# Altium schematic sheet Sheet2.SchDoc
size A3
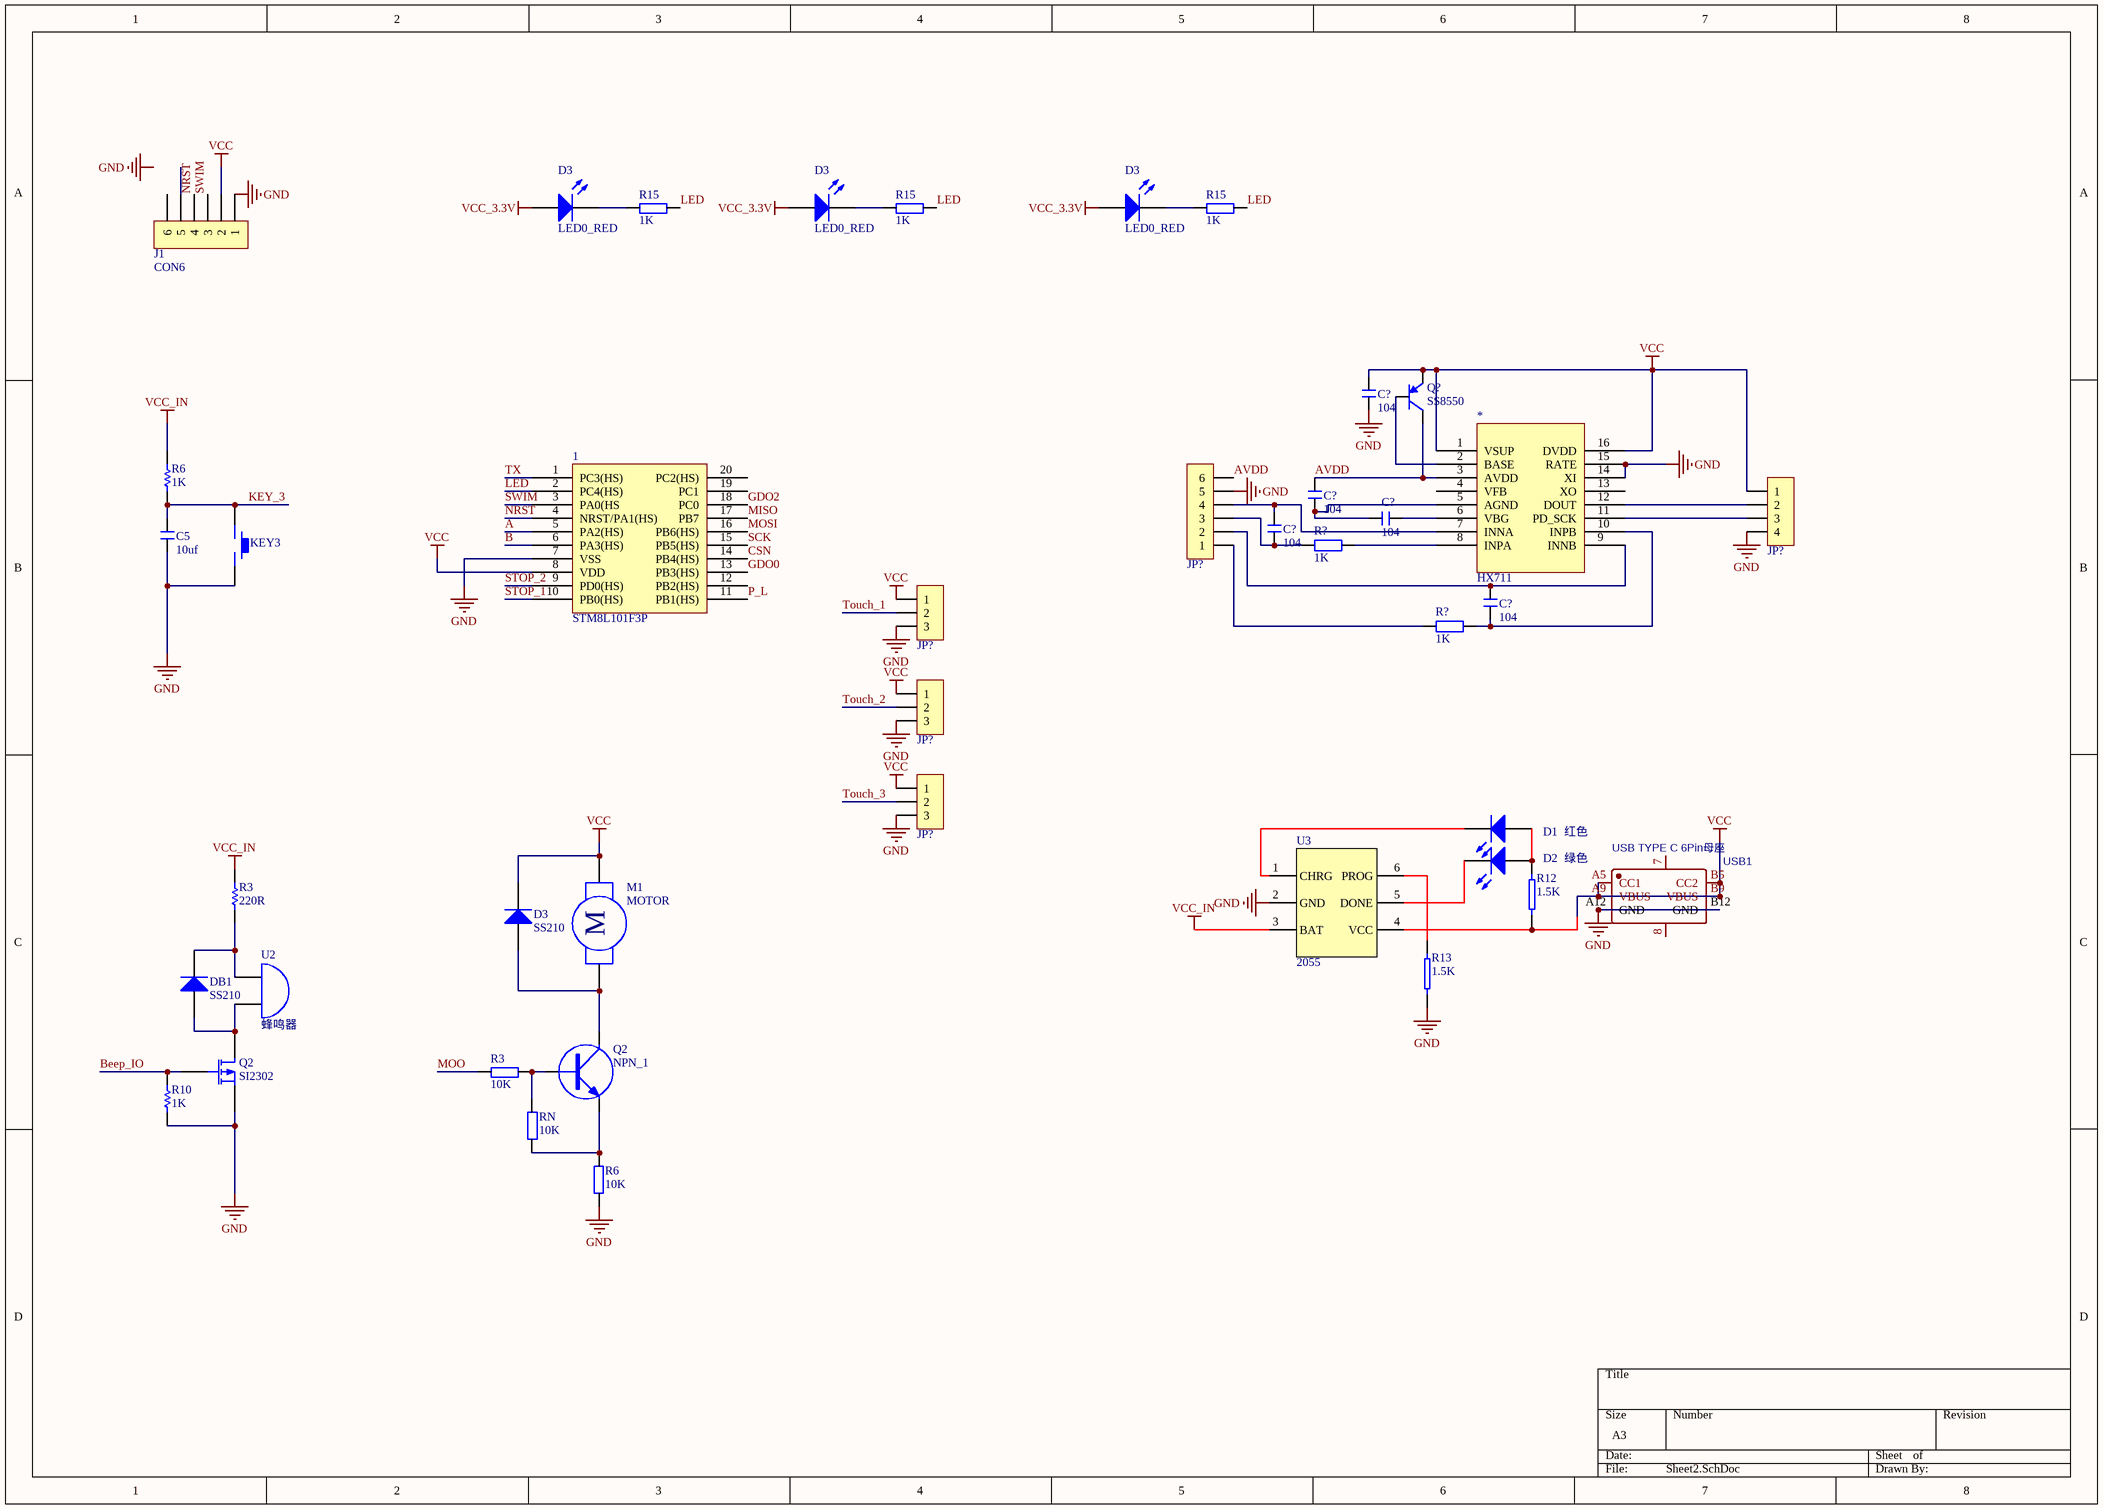
[diagram p0: Sheet2.SchDoc]

## Parts
(Parts that share a designator on the sheet are numbered #1, #2 ... from top to bottom, then left to right.)
1  STM8L101F3P  [TSSOP20]
*  HX711  [Model Name]
C5  10uf  [C0805]
C?#1  104  [C 0201_L]
C?#2  104  [C 0201_L]
C?#3  104  [C 0201_L]
C?#4  104  [C 0201_L]
C?#5  104  [C 0201_L]
D1  红色  [led0805]
D2  绿色  [led0805]
D3#1  LED0_RED  [LED0805]
D3#2  LED0_RED  [LED0805]
D3#3  LED0_RED  [LED0805]
D3#4  SS210  [1206]
DB1  SS210  [1206]
J1  CON6  [HDR2.54-LI-4P]
JP?#1  HDR-1X4  [HDR2.54-LI-4P]  (value not drawn)
JP?#2  HDR-1X6  [HDR2.54-LI-6P]  (value not drawn)
JP?#3  HDR-1X3  [HDR2.54-LI-3P]  (value not drawn)
JP?#4  HDR-1X3  [HDR2.54-LI-3P]  (value not drawn)
JP?#5  HDR-1X3  [HDR2.54-LI-3P]  (value not drawn)
KEY3  KEY_M  [SW_PB4_A1]  (value not drawn)
M1  MOTOR  [0805]
Q2#1  NPN_1  [SOT-23]
Q2#2  SI2302  [SOT-23]
Q?  SS8550  [SOT23-3L]
R3#1  value 220R  [0805]  (hidden comment: Res)
R3#2  10K  [0805]
R6#1  value 1K  [0805]  (hidden comment: Res)
R6#2  10K  [0805]
R10  value 1K  [0805]  (hidden comment: Res)
R12  1.5K  [0805]
R13  1.5K  [0805]
R15#1  1K  [0805]
R15#2  1K  [0805]
R15#3  1K  [0805]
R?#1  1K  [R 0201_L]
R?#2  1K  [R 0201_L]
RN  10K  [R0805]
U2  蜂鸣器  [BELL 5mm]
U3  2055  [SOT23-6L]
USB1  USB TYPE C 6Pin母座  [USB-C-SMD_10P-P1.00-L6.8-W8.9]

## Nets
GND: 1.7(VSS) *.14(XI) *.15(RATE) C5.1 C?#1.1 J1.1 JP?#1.4 JP?#2.5 JP?#3.3 JP?#4.3 JP?#5.3 KEY3.2 Q2#2.S R6#2.2 R10.1 R13.2 U3.2(GND) USB1.A12(GND) USB1.B12(GND)
VCC: 1.8(VDD) *.1(VSUP) *.16(DVDD) C?#1.2 D3#4.2(K) J1.2 JP?#1.1 JP?#3.1 JP?#4.1 JP?#5.1 M1.1 Q?.2(E) R12.1 U3.4(VCC) USB1.A5(CC1) USB1.A9(VBUS) USB1.B5(CC2) USB1.B9(VBUS)
VCC_3.3V: D3#1.1(A) D3#2.1(A) D3#3.1(A)
VCC_IN: R3#1.2 R6#1.1 U3.3(BAT)
A: 1.5(PA2(HS))
AVDD: *.3(AVDD) C?#2.2 JP?#2.6 Q?.3(C)
B: 1.6(PA3(HS))
Beep_IO: Q2#2.G R10.2
CSN: 1.14(PB4(HS))
GDO0: 1.13(PB3(HS))
GDO2: 1.18(PC0)
KEY_3: C5.2 KEY3.1 R6#1.2
LED: 1.2(PC4(HS)) R15#1.2 R15#2.2 R15#3.2
MISO: 1.17(PB7)
MOO: R3#2.1
MOSI: 1.16(PB6(HS))
NRST: 1.4(NRST/PA1(HS)) J1.4
P_L: 1.11(PB1(HS))
SCK: 1.15(PB5(HS))
STOP_1: 1.10(PB0(HS))
STOP_2: 1.9(PD0(HS))
SWIM: 1.3(PA0(HS) J1.3
Touch_1: JP?#3.2
Touch_2: JP?#4.2
Touch_3: JP?#5.2
TX: 1.1(PC3(HS))
Net*_2: *.2(BASE) Q?.1(B)
Net*_5: *.5(AGND) C?#2.1 C?#3.2
Net*_6: *.6(VBG) C?#3.1
Net*_7: *.7(INNA) C?#4.2 JP?#2.4
Net*_8: *.8(INPA) R?#1.2
Net*_9: *.9(INNB) C?#5.2 JP?#2.2
Net*_10: *.10(INPB) C?#5.1 R?#2.2
Net*_11: *.11(PD_SCK) JP?#1.3
Net*_12: *.12(DOUT) JP?#1.2
NetC?#4_1: C?#4.1 JP?#2.3 R?#1.1
NetD1_1: D1.1 D2.1 R12.2
NetD1_2: D1.2 U3.1(CHRG)
NetD2_2: D2.2 U3.5(DONE)
NetD3#1_2: D3#1.2(K) R15#1.1
NetD3#2_2: D3#2.2(K) R15#2.1
NetD3#3_2: D3#3.2(K) R15#3.1
NetD3#4_1: D3#4.1(A) M1.2 Q2#1.3(C)
NetDB1_1: DB1.1(A) Q2#2.D U2.2(B)
NetDB1_2: DB1.2(K) R3#1.1 U2.1(A)
NetJP?#2_1: JP?#2.1 R?#2.1
NetQ2#1_1: Q2#1.1(E) R6#2.1 RN.1
NetQ2#1_2: Q2#1.2(B) R3#2.2 RN.2
NetR13_1: R13.1 U3.6(PROG)

Not connected (* = marked no-connect by the designer): 1 12(PB2(HS)) 19(PC1) 20(PC2(HS)); * 4(VFB) 13(XO); J1 5 6; USB1 7 8

## Notes on the sheet
- Labels drawn without touching a wire or pin: GND
- (in symbol MOTOR) M

## Library data of the parts
C5 = C: 无极性贴片电容; 版权归属: 源创客; BOM名称: 无极性贴片电容; 学习资源: www.ooocke.com
C?#1-C?#5 = C: 贴片电容; BOM名称: 无极性贴片电容; 优秀评价可免费更新: 联系淘宝ID：黄晶宝石，获取更新版封装库; 卖家免费技术支持，联系售后: 唯一出售店铺网址https://shop463601444.taobao.com; 本封装库来自淘宝卖家 ID：黄晶宝石: 其他店铺购入均为盗版，请立即申请退款
D1 D2 = LED
D3#1-D3#3 = LED2: Typical RED, GREEN, YELLOW, AMBER GaAs LED; Published: 8-Jun-2000; LatestRevisionDate: 17-Jul-2002; LatestRevisionNote: Re-released for DXP Platform.; PackageVersion: Feb-2002; PackageReference: 3.2X1.6X1.1; Publisher: Altium Limited
D3#4 DB1 = SMA(DO-214AC) SS210: 二极管; ComponentLink1Description: 供应商链接; ComponentLink1URL: http://www.szlcsc.com/product/details_15669.html; Package: SMA(DO-214AC); Supplier: LC; SuppliersPartNumber: C14996
J1 = CON6: Connector
JP?#1 = Header 4: 4P接插件; 版权归属: 封装库来自淘宝 ID：黄晶宝石; 优秀评价可免费更新: 联系淘宝ID：黄晶宝石，获取更新版封装库; 卖家免费技术支持，联系售后: 唯一出售店铺网址https://shop463601444.taobao.com; BOM名称: 4P接插件
JP?#2 = Header 6: 6P接插件; 版权归属: 封装库来自淘宝 ID：黄晶宝石; 优秀评价可免费更新: 联系淘宝ID：黄晶宝石，获取更新版封装库; 卖家免费技术支持，联系售后: 唯一出售店铺网址https://shop463601444.taobao.com; BOM名称: 6P接插件
JP?#3-JP?#5 = Header 3: 3P接插件; 版权归属: 封装库来自淘宝 ID：黄晶宝石; 优秀评价可免费更新: 联系淘宝ID：黄晶宝石，获取更新版封装库; 卖家免费技术支持，联系售后: 唯一出售店铺网址https://shop463601444.taobao.com; BOM名称: 3P接插件
KEY3 = KEY_M: pin to pad: 1>4 2>3
Q2#1 = NPN_1: NPN Transistor; pin to pad: 1>2 2>1
Q2#2 = MOSFET-P: P-Channel MOSFET; pin to pad: D>3 G>1 S>2; 卖家免费技术支持，联系售后: 唯一出售店铺网址https://shop463601444.taobao.com; 封装库来自淘宝卖家 ID：黄晶宝石: 其他店铺购入均为假冒，请申请退款，本店现金奖励
Q? = 8550-SMD: 高频放大-PNP型; 属性: 40V 1.5A 1W 100MHZ; 卖家免费技术支持，联系售后: 唯一出售店铺网址https://shop463601444.taobao.com; 封装库来自淘宝卖家 ID：黄晶宝石: 其他店铺购入均为假冒，请立即申请退款，本店奖励2~5元现金; BOM名称: 高频放大-PNP型
R3#1 R6#1 R10 = Res: Resistor; Published: 8-Jun-2000; LatestRevisionDate: 17-Jul-2002; LatestRevisionNote: Re-released for DXP Platform.; PackageReference: AXIAL-0.3; Publisher: Altium Limited; PackageDescription: Axial Device, Thru-Hole; 2 Leads; 0.3 in Pin Spacing
R3#2 R6#2 R15#1-R15#3 RN = R
R12 R13 = RES
R?#1 R?#2 = R: 贴片电阻; 优秀评价可免费更新: 联系淘宝ID：黄晶宝石，获取更新版封装库; 卖家免费技术支持，联系售后: 唯一出售店铺网址https://shop463601444.taobao.com; 本封装库来自淘宝卖家 ID：黄晶宝石: 其他店铺购入均为盗版，请立即申请退款; BOM名称: 贴片电阻
U2 = 蜂鸣器: Bell
U3 = MCU-6
USB1 = USB TYPE C 6Pin母座: pin to pad: A5>4 A9>2 A12>6 B5>3 B9>5 B12>1; BOM_Manufacturer: XUNPU; BOM_Manufacturer Part: TYC-252D-CB160; Contributor: LCSC; BOM_Supplier: LCSC; BOM_Supplier Part: C381473; spicePre: U; spiceSymbolName: TYC-252D-CB160